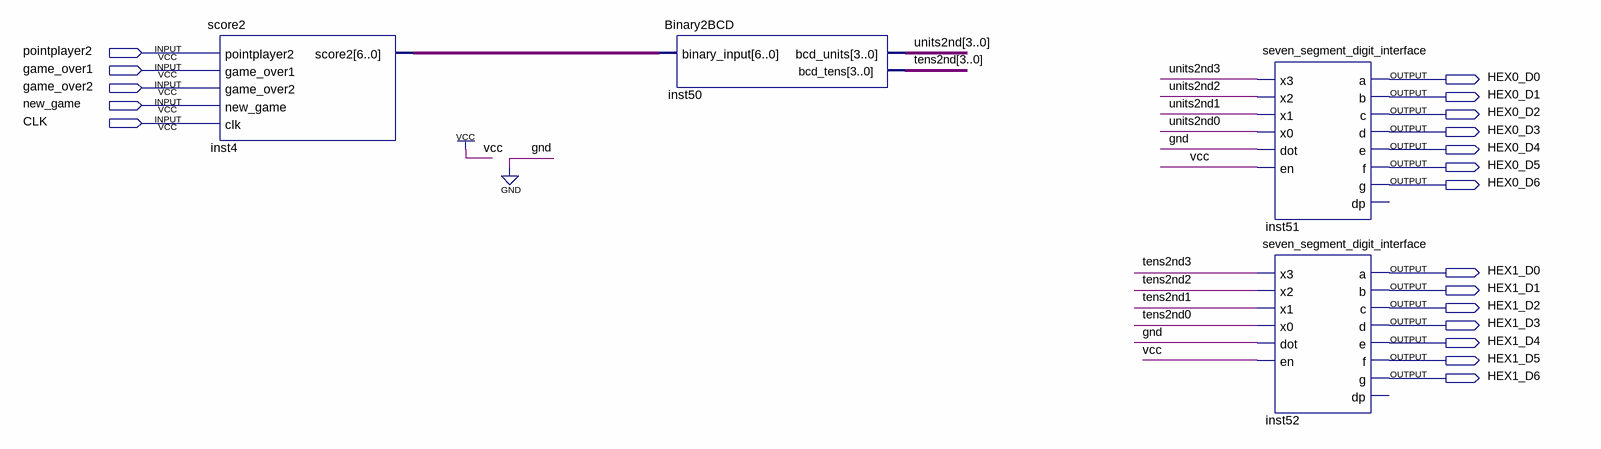
[diagram p0: schematic sheet]
// Quartus schematic Slave_FPGA.bdf as structural Verilog: 4 symbols, 19 pins
module Slave_FPGA (
  input  pointplayer2,
  input  game_over1,
  input  game_over2,
  input  new_game,
  input  CLK,
  output HEX0_D0,
  output HEX0_D1,
  output HEX0_D2,
  output HEX0_D3,
  output HEX0_D4,
  output HEX0_D5,
  output HEX0_D6,
  output HEX1_D0,
  output HEX1_D1,
  output HEX1_D2,
  output HEX1_D3,
  output HEX1_D4,
  output HEX1_D5,
  output HEX1_D6
);

  wire [3:0] tens2nd, units2nd;
  wire [6:0] inst4_score2;

  score2 inst4 (
    .pointplayer2(pointplayer2), .game_over1(game_over1), .game_over2(game_over2), .new_game(new_game),
    .clk(CLK), .score2(inst4_score2));
  Binary2BCD inst50 (.binary_input(inst4_score2), .bcd_units(units2nd), .bcd_tens(tens2nd));
  seven_segment_digit_interface inst51 (
    .x3(units2nd[3]), .x2(units2nd[2]), .x1(units2nd[1]), .x0(units2nd[0]), .dot(1'b0), .en(1'b1),
    .a(HEX0_D0), .b(HEX0_D1), .c(HEX0_D2), .d(HEX0_D3), .e(HEX0_D4), .f(HEX0_D5), .g(HEX0_D6));  // open: dp
  seven_segment_digit_interface inst52 (
    .x3(tens2nd[3]), .x2(tens2nd[2]), .x1(tens2nd[1]), .x0(tens2nd[0]), .dot(1'b0), .en(1'b1), .a(HEX1_D0),
    .b(HEX1_D1), .c(HEX1_D2), .d(HEX1_D3), .e(HEX1_D4), .f(HEX1_D5), .g(HEX1_D6));  // open: dp
endmodule
